# Altium schematic sheet schematic diagram.schdoc
size 309 x 223 mm; Symbol: Sheet-Symbol_A4; Device: Sheet-Symbol_A4; Company: 嘉立创EDA; Version: V1.0; Page Size: A4; @Project Name: MorseLink --- CW电键转接器; @Page Count: 1; @Update Date: 2024-08-31; @Create Date: 2024-08-14; @Schematic Name: Schematic1; @Page No: 1; @Page Name: P1; @Board Name: CW_converter; @Create Time: 16:36:05; @Update Time: 17:32:40
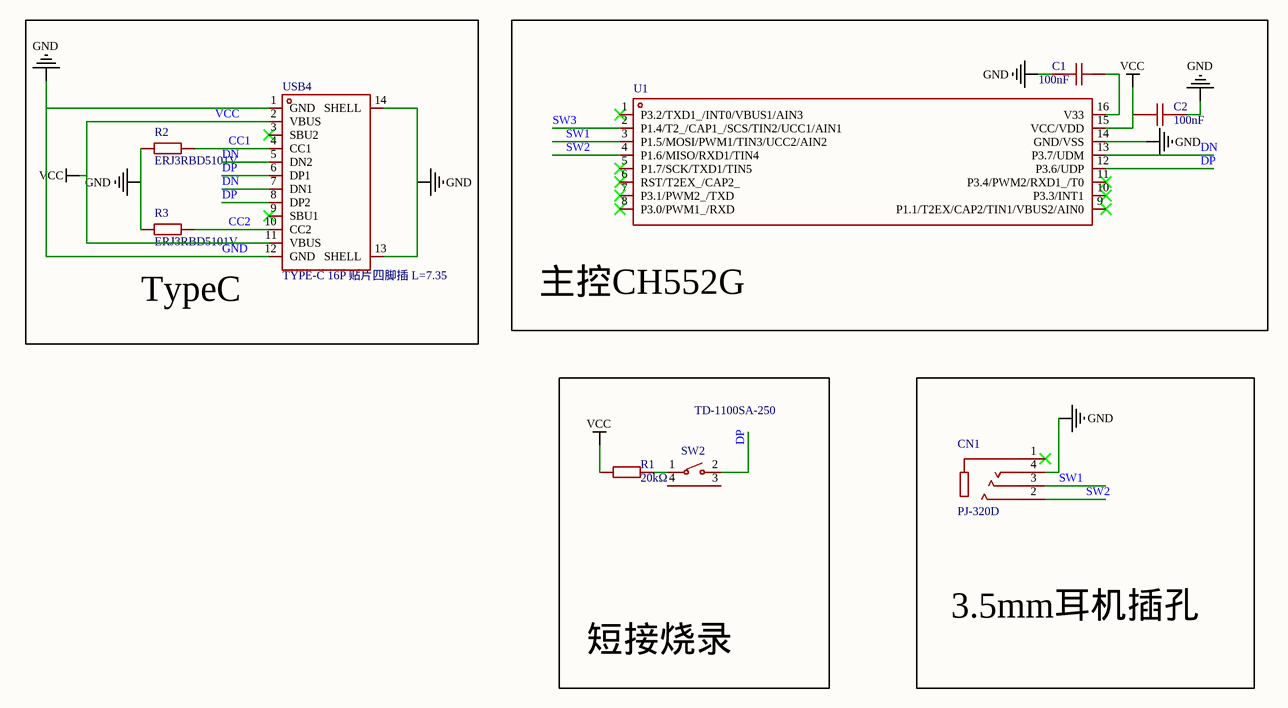
[diagram p0: schematic diagram.schdoc]

## Parts
C1  value 100nF  [C0603]  (hidden comment: CC0603KRX7R9BB104)
C2  value 100nF  [C0603]  (hidden comment: CC0603KRX7R9BB104)
CN1  PJ-320D  [AUDIO-SMD_PJ-320D]  (value not drawn)
R1  value 20kΩ  [R0603]  (hidden comment: 0603WAF2002T5E)
R2  ERJ3RBD5101V  [R0603]  (value not drawn)
R3  ERJ3RBD5101V  [R0603]  (value not drawn)
SW2  TD-1100SA-250  [SW-SMD_TD-1100SA-250]  (value not drawn)
U1  CH552G  [SOP-16_L10.0-W3.9-P1.27-LS6.0-BL]  (value not drawn)
USB4  TYPE-C 16P 贴片四脚插 L=7.35  [USB-C-SMD_TYPE-C-6PIN-2MD-073]  (value not drawn)

## Blocks framed on the sheet
TypeC: R2 R3 USB4
主控CH552G: C1 C2 U1
短接烧录: R1 SW2
3.5mm耳机插孔: CN1

## Nets
GND: C1.1 C2.2 CN1.4 R2.1 R3.1 U1.14(GND/VSS) USB4.1(GND) USB4.12(GND) USB4.13(SHELL) USB4.14(SHELL)
VCC: C2.1 R1.2 U1.15(VCC/VDD) USB4.2(VBUS) USB4.11(VBUS)
CC1: R2.2 USB4.4(CC1)
CC2: R3.2 USB4.10(CC2)
DN: U1.13(P3.7/UDM) USB4.5(DN2) USB4.7(DN1)
DP: SW2.2 U1.12(P3.6/UDP) USB4.6(DP1) USB4.8(DP2)
SW1: CN1.3 U1.3(P1.5/MOSI/PWM1/TIN3/UCC2/AIN2)
SW2: CN1.2 U1.4(P1.6/MISO/RXD1/TIN4)
SW3: U1.2(P1.4/T2_/CAP1_/SCS/TIN2/UCC1/AIN1)
NetC1_2: C1.2 U1.16(V33)
NetR1_1: R1.1 SW2.1

Not connected (* = marked no-connect by the designer): CN1 1*; SW2 3 4; U1 1(P3.2/TXD1_/INT0/VBUS1/AIN3)* 5(P1.7/SCK/TXD1/TIN5)* 6(RST/T2EX_/CAP2_)* 7(P3.1/PWM2_/TXD)* 8(P3.0/PWM1_/RXD)* 9(P1.1/T2EX/CAP2/TIN1/VBUS2/AIN0)* 10(P3.3/INT1)* 11(P3.4/PWM2/RXD1_/T0)*; USB4 3(SBU2)* 9(SBU1)*

## Notes on the sheet
- 1
- 2
- 3
- 4
- 5
- 6
- A
- B
- C
- 原理图
- Schematic1
- 创建日期
- 更新日期
- 2024-08-31
- 2024-08-14
- 审阅
- 绘制
- 图页
- P1
- 物料编码
- MorseLink --- CW电键转接器
- D
- 版本
- 尺寸
- 页
- 共
- V1.0
- A4
- 嘉立创EDA

## Library data of the parts
C1 C2 = CC0603KRX7R9BB104: 容值:100nF;精度:±10%;额定电压:50V;材质(温度系数):X7R;; Manufacturer: YAGEO(国巨); Add into BOM: yes; Tolerance: ±10%; Voltage Rated: 50V; Temperature Coefficient: X7R; Symbol: CC0603KRX7R9BB104; Device: CC0603KRX7R9BB104; LCSC Part Name: 100nF ±10% 50V; Supplier Part: C14663; Manufacturer Part: CC0603KRX7R9BB104; Supplier Footprint: 0603; JLCPCB Part Class: Basic Part; Datasheet: https://atta.szlcsc.com/upload/public/pdf/source/20170116/1484561234239.pdf; Supplier: LCSC; Convert to PCB: yes
CN1 = PJ-320D_C431535: 连接器类型:3.5mm耳机座;额定电流:300mA;额定电压:50V;工作温度范围:-16℃~+65℃;; Manufacturer: SHOU HAN(首韩); Add into BOM: yes; Current Rating (Max): 300mA; Voltage Rating (Max): 50V; Symbol: PJ-320D; Device: PJ-320D_C431535; LCSC Part Name: 3.5mm耳机座; Supplier Part: C431535; Manufacturer Part: PJ-320D; Supplier Footprint: SMD; JLCPCB Part Class: 扩展库; Datasheet: https://atta.szlcsc.com/upload/public/pdf/source/20190925/C431535_8B274506621F6117FB020BF07A197848.pdf; Supplier: LCSC; Convert to PCB: yes; Connector Type: 3.5mm耳机座; Operating Temperature Range: -16℃~+65℃
R1 = 0603WAF2002T5E: 电阻类型:厚膜电阻;阻值:20kΩ;精度:±1%;功率:100mW;温度系数:±100ppm/;最大工作电压:75V;工作温度范围:-55~+155;; Manufacturer: UNI-ROYAL(厚声); Add into BOM: yes; Tolerance: ±1%; Power(Watts): 100mW; Overload Voltage (Max): 75V; Symbol: 0603WAF2002T5E; Device: 0603WAF2002T5E; LCSC Part Name: 20kΩ ±1% 100mW; Supplier Part: C4184; Manufacturer Part: 0603WAF2002T5E; Supplier Footprint: 0603; JLCPCB Part Class: Basic Part; Datasheet: https://atta.szlcsc.com/upload/public/pdf/source/20200306/C422600_1E6D84923E4A46A82E41ADD87F860B5C.pdf; Supplier: LCSC; Convert to PCB: yes; Type: 厚膜电阻; Temperature Coefficient: ±100ppm/; Operating Temperature Range: -55~+155
R2 R3 = ERJ3RBD5101V: Manufacturer: PANASONIC(松下); Symbol: ERJ-3RBD5101V; Add into BOM: yes; Device: ERJ3RBD5101V; LCSC Part Name: 5.1KΩ(5101) ±0.5%; Supplier Part: C191782; Manufacturer Part: ERJ3RBD5101V; Supplier Footprint: 0603; JLCPCB Part Class: Extended Part; Datasheet: https://atta.szlcsc.com/upload/public/pdf/source/20180502/C191782_45CEAE8EC75CD88F6E48993D042FDD2A.pdf; Supplier: LCSC; Convert to PCB: yes
SW2 = TD-1100SA-250: Manufacturer: DEALON(德艺隆); Add into BOM: yes; Symbol: TD-1100SA-250; Device: TD-1100SA-250; LCSC Part Name: TD-1100SA-250 侧按; Supplier Part: C2905201; Manufacturer Part: TD-1100SA-250; Supplier Footprint: SMD; JLCPCB Part Class: Extended Part; Datasheet: https://atta.szlcsc.com/upload/public/pdf/source/20211209/3FE33918AAAC3B027476F5D861A76BF1.pdf; Supplier: LCSC; Convert to PCB: yes
U1 = CH552G: CPU内核:51系列;CPU最大主频:24MHz;工作电压范围:3.3V~5V;内部振荡器:有;外部时钟频率范围:6MHz~25MHz;程序 FLASH容量:16KB;RAM总容量:1.25KB;EEPROM/数据 FLASH容量:128Byte;GPIO端口数量:-;ADC(单元数/通道数/位数):1@x4ch/8bit;DAC(单元数/通道数/位数):-;(E)PWM(单元数/通道数/位数):2@x8bit;8位Timer数量:-;16位Timer数量:3;32位Timer数量:-;内部比较器数量:-; Manufacturer: WCH(南京沁恒); Add into BOM: yes; CPU Core: 51系列; Maximum Frequency: 24MHz; Internal Oscillator: 有; Program FLASH Size: 16KB; RAM Size: 1.25KB; 16Bit Timer Number: 3; U(S)ART Number: 2; (Q)SPI Number: 1; USB (H/D/OTG): 全速USB Device; Peripherals / Functions / Protocol Stacks: DMA；看门狗；CCP捕获/比较；触控按键; Symbol: CH552G; Device: CH552G; LCSC Part Name: CH552G; Supplier Part: C111292; Manufacturer Part: CH552G; Supplier Footprint: SOP-16_150mil; JLCPCB Part Class: Extended Part; Datasheet: https://atta.szlcsc.com/upload/public/pdf/source/20200819/C111292_2988E0DDEDF937C7B5A075A68BF2AC9C.pdf; Supplier: LCSC; Convert to PCB: yes; Supply Voltage Range: 3.3V~5V; External Clock Frequency Rang: 6MHz~25MHz; EEPROM/Data FLASH Size: 128Byte; GPIO Ports Number: -; ADC (Units/Channels/bits): 1@x4ch/8bit; DAC (Units/Channels/bits): -; (E)PWM (Units/Channels/bits): 2@x8bit; 8Bit Timer Number: -; 32Bit Timer Number: -; CMP Number: -; I2C Number: -; I2S Number: -; CAN Number: -; Operating Temperature Range: -40~+85
USB4 = TYPE-C 16P 贴片四脚插 L=7.35: Add into BOM: yes; Symbol: TYPE-C 16P 贴片四脚插 L=7.35; Device: TYPE-C 16P 贴片四脚插 L=7.35; LCSC Part Name: TYPE-C 16P 贴片四脚插 L=7.35; Supplier Part: C9900004817; Manufacturer Part: TYPE-C 16P 贴片四脚插 L=7.35; Supplier Footprint: type-c 16PIN; JLCPCB Part Class: 扩展库; Supplier: LCSC; Convert to PCB: yes